# Altium schematic sheet Sensors.SchDoc
size A; SheetNumber: 3; SheetTotal: 4
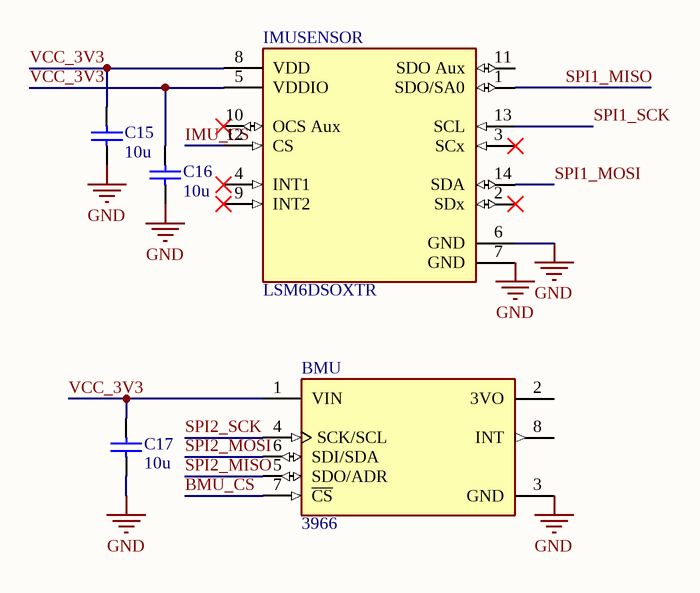
[diagram p0: Sensors.SchDoc]

## Parts
BMU  3966  [FP-3966-MFG]
C15  value 10u  (hidden comment: Capacitor)
C16  value 10u  (hidden comment: Capacitor)
C17  value 10u  (hidden comment: Capacitor)
IMUSENSOR  LSM6DSOXTR  [FP-LGA-14L-DM00249496-MFG]

## Nets
GND: BMU.3(GND) C15.1 C16.1 C17.1 IMUSENSOR.6(GND) IMUSENSOR.7(GND)
BMU_CS: BMU.7(~{CS})
IMU_CS: IMUSENSOR.12(CS)
SPI1_MISO: IMUSENSOR.1(SDO/SA0)
SPI1_MOSI: IMUSENSOR.14(SDA)
SPI1_SCK: IMUSENSOR.13(SCL)
SPI2_MISO: BMU.5(SDO/ADR)
SPI2_MOSI: BMU.6(SDI/SDA)
SPI2_SCK: BMU.4(SCK/SCL)
VCC_3V3: BMU.1(VIN) C15.2 C16.2 C17.2 IMUSENSOR.5(VDDIO) IMUSENSOR.8(VDD)

Not connected (* = marked no-connect by the designer): BMU 2(3VO) 8(INT); IMUSENSOR 2(SDx)* 3(SCx)* 4(INT1)* 9(INT2)* 10(OCS_Aux)* 11(SDO_Aux)

## Library data of the parts
BMU = CMP-144239-000001-1: BMP388 - PRECISION BAROMETRIC PR
C15-C17 = Capacitor: SimulationGenericComponent: True
IMUSENSOR = CMP-12177-000010-1: INEMO INERTIAL MODULE: 3D ACCELE; Manufacturer: STMicroelectronics; Sensor Type: Temperature,Accelerometer,Gyroscope; Accel Range: 2/4/8/16g; Accel Sensitivity: 0.061/0.122/0.244/0.488mV/g; Operating Supply Current: 0.55mA; Gyro Range: 125/250/500/1000/2000°/s; Gyro Sensitivity: 4.375/8.75/17.5/35/70LSB/°/s; Sensor Output: I2C,SPI,Other; Min Supply Voltage: 1.62V; Max Supply Voltage: 3.6V; Description: Accelerometer, Gyroscope, 6 Axis Sensor I²C, SPI Output; Octopart: https://octopart.com/lsm6dsoxtr-stmicroelectronics-98102600; Package: LGA-14L-DM00249496; Footprint Url: https://www.st.com/content/ccc/resource/technical/document/technical_note/73/17/9c/16/dd/96/4a/01/CD00134799.pdf/files/CD00134799.pdf/jcr:content/translations/en.CD00134799.pdf; ComponentLink2Description: Datasheet; Mouser Description: LSM6DSOX: 3.6 V 3 Axis Accelerometer Gyroscope iNEMO Inertial Module - LGA-14L; ComponentLink2URL: https://www.st.com/resource/en/datasheet/lsm6dsox.pdf; Temperature Range Low: -40°C; Digikey Description: INEMO INERTIAL MODULE: 3D ACCELE; Lead Free: Yes; Device Class L3: Inertial Measurement Units (IMUs); Category: IC; Device Class L2: Motion Sensors; RoHS: TRUE; Temperature: -40°C to +85°C; Height: 0.86mm; Device Class L1: Sensors; Temperature Range High: +85°C; Manufacturer Part Number: LSM6DSOXTR; Automotive: No